# EAGLE design basic-inline-turbidimeter_main_board_v2.1.1 (EAGLE 7.7.0)
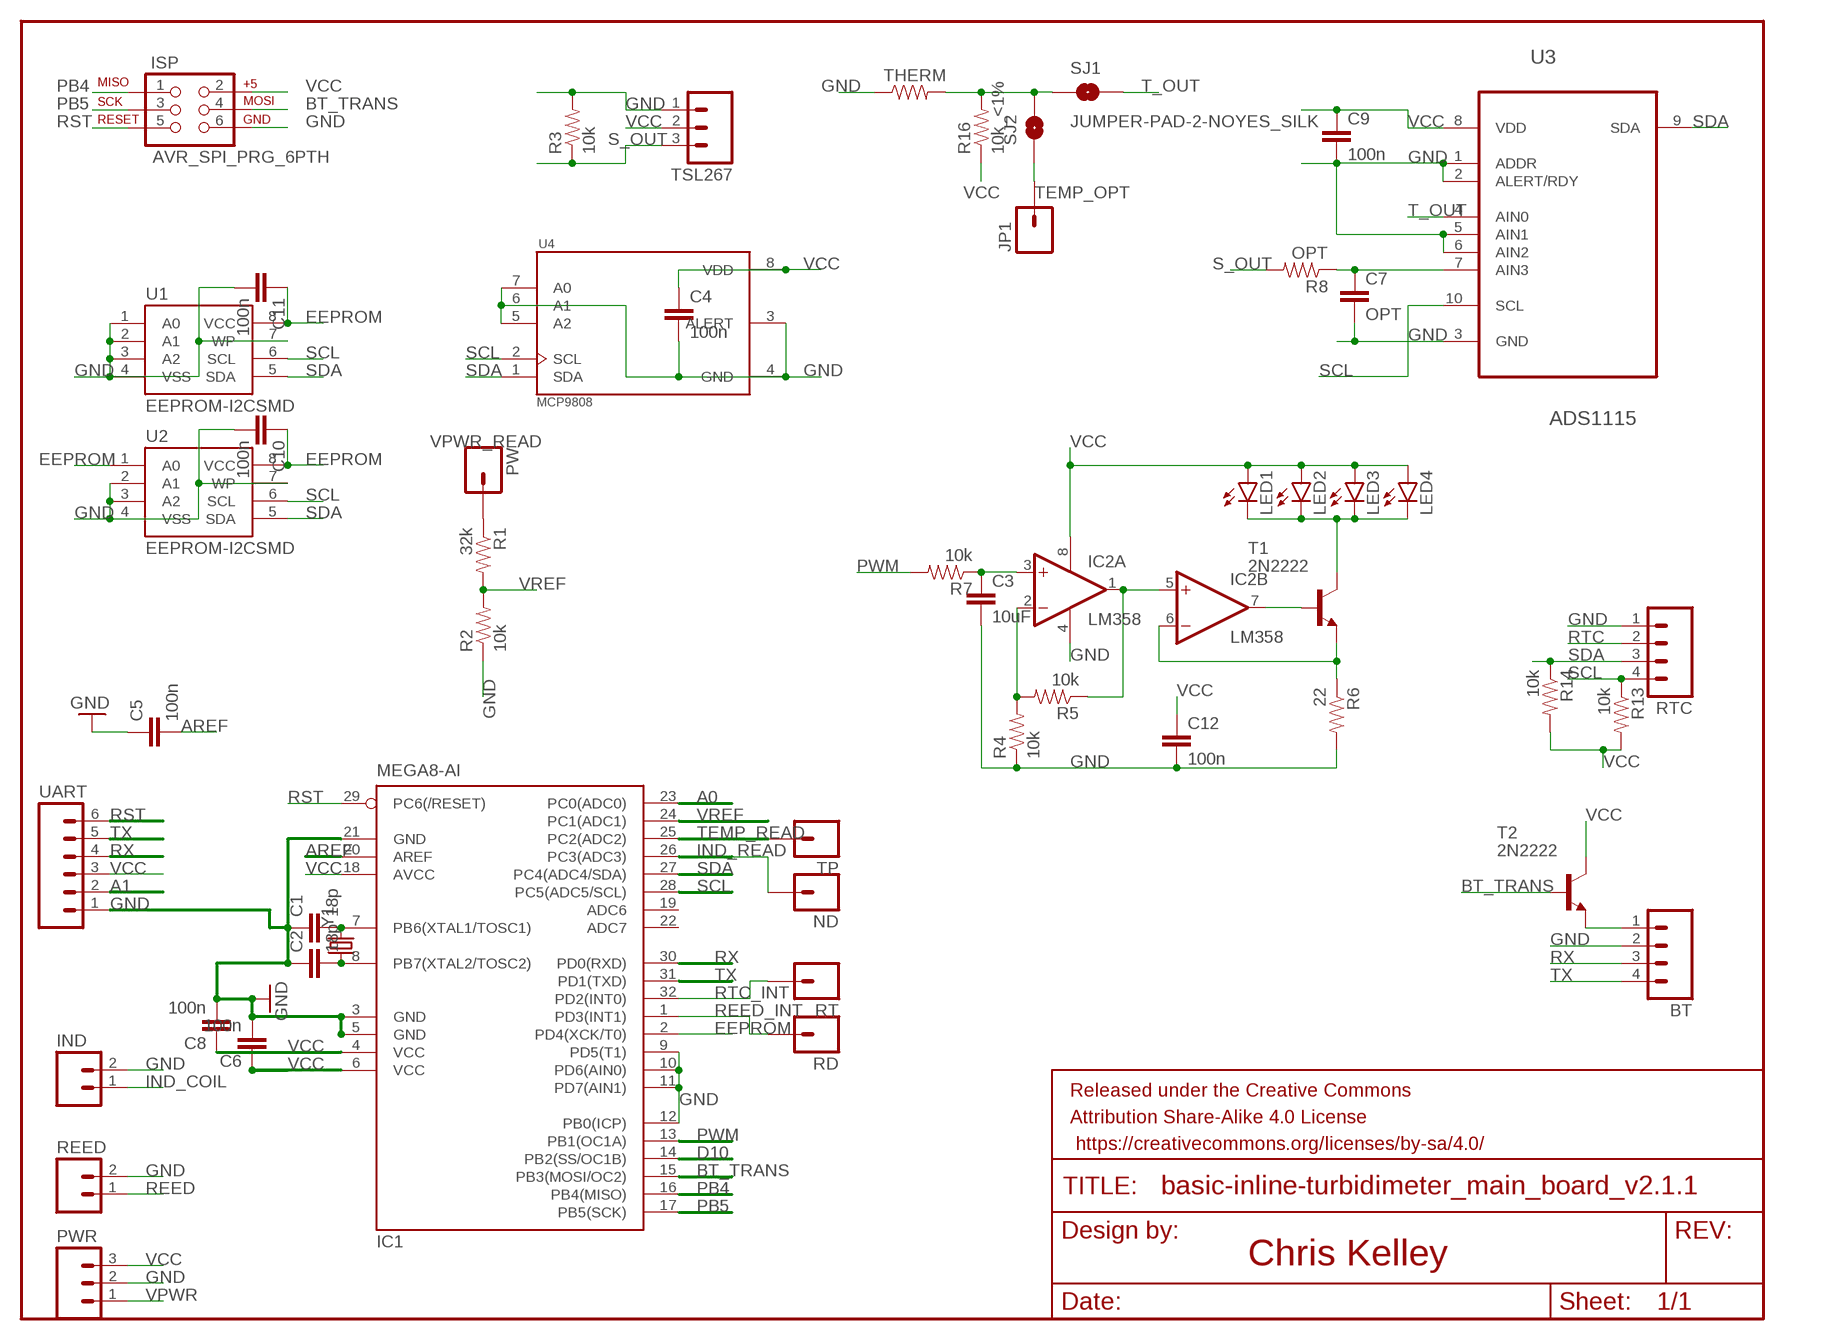
[diagram p0: schematic, sheet 1]

## Parts
BT  M04PTH  [1X04]
C1  18p  CAP0603-CAP  [0603-CAP]
C2  18p  CAP0603-CAP  [0603-CAP]
C3  10uF  CAP0603-CAP  [0603-CAP]
C4  100n  CAP0603-CAP  [0603-CAP]
C5  100n  CAP0603-CAP  [0603-CAP]
C6  100n  CAP0603-CAP  [0603-CAP]
C7  OPT  CAP0603-CAP  [0603-CAP]
C8  100n  CAP0603-CAP  [0603-CAP]
C9  100n  CAP0603-CAP  [0603-CAP]
C10  100n  CAP0603-CAP  [0603-CAP]
C11  100n  CAP0603-CAP  [0603-CAP]
C12  100n  CAP0603-CAP  [0603-CAP]
FRAME1  FRAME-LETTER  [CREATIVE_COMMONS]
IC1  MEGA8-AI  [TQFP32-08]
IC2  LM358  LM358D  [SO08]
IND  M02PTH  [1X02]
ISP  AVR_SPI_PRG_6PTH  [2X3]
JP1  M01PTH  [1X01]
LED1  LED5MM  [LED5MM]
LED2  LED5MM  [LED5MM]
LED3  LED5MM  [LED5MM]
LED4  LED5MM  [LED5MM]
ND  M01PTH  [1X01]
PW  M01PTH  [1X01]
PWR  M03PTH  [1X03]
R1  32k  RESISTOR0603  [0603-RES]
R2  10k  RESISTOR0603  [0603-RES]
R3  10k  RESISTOR0603  [0603-RES]
R4  10k  RESISTOR0603  [0603-RES]
R5  10k  RESISTOR0603  [0603-RES]
R6  22  RESISTOR0603  [0603-RES]
R7  10k  RESISTOR0603  [0603-RES]
R8  OPT  RESISTOR0603  [0603-RES]
R13  10k  RESISTOR0603  [0603-RES]
R14  10k  RESISTOR0603  [0603-RES]
R16  10k_<1%  RESISTOR0603-RES  [0603-RES]
RD  M01PTH  [1X01]
REED  M02PTH  [1X02]
RT  M01PTH  [1X01]
RTC  M04PTH  [1X04]
SJ1  JUMPER-PAD-2-NOYES_SILK  [PAD-JUMPER-2-NO_YES_SILK]
SJ2  JUMPER-PAD-2-NOYES_SILK  [PAD-JUMPER-2-NO_YES_SILK]
T1  2N2222  [TO92-EBC-OVAL]
T2  2N2222  [TO92-EBC-OVAL]
THERM  RESISTOR0603-RES  [0603-RES]
TP  M01PTH  [1X01]
TSL267  M03PTH  [1X03]
U1  EEPROM-I2CSMD  [SO08]
U2  EEPROM-I2CSMD  [SO08]
U3  ADS1115  ADS1115IDGST  [SOP50P490X110-10N]
U4  MCP9808  MCP9808-E/MS  [SOP65P490X110-8N]
UART  M06SILK_FEMALE_PTH  [1X06]
Y1  CRYSTAL5X3  [CRYSTAL-SMD-5X3]

## Nets
A0: IC1.23(PC0(ADC0))
A1: UART.2
AREF: C5.2 IC1.20(AREF)
BT_TRANS: IC1.15(PB3(MOSI/OC2)) ISP.4 T2.B
D10: IC1.14(PB2(SS/OC1B))
EEPROM: C10.1 C11.1 IC1.2(PD4(XCK/T0)) U1.8(VCC) U2.1(A0) U2.8(VCC)
GND: BT.2 C1.1 C2.1 C3.2 C4.2 C5.1 C6.2 C7.2 C8.2 C9.2 C10.2 C11.2 C12.2 IC1.3(GND) IC1.5(GND) IC1.9(PD5(T1)) IC1.10(PD6(AIN0)) IC1.11(PD7(AIN1)) IC1.12(PB0(ICP)) IC1.21(GND) IC2.4(P:V-) IND.2 ISP.6 PWR.2 R2.1 R3.2 R4.1 R6.2 REED.2 RTC.1 THERM.1 TSL267.1 U1.1(A0) U1.2(A1) U1.3(A2) U1.4(VSS) U1.7(WP) U2.2(A1) U2.3(A2) U2.4(VSS) U2.7(WP) U3.1(ADDR) U3.2(ALERT/RDY) U3.3(GND) U3.5(AIN1) U3.6(AIN2) U4.3(ALERT) U4.4(GND) U4.5(A2) U4.6(A1) U4.7(A0) UART.1
IND_COIL: IND.1
IND_READ: IC1.26(PC3(ADC3)) ND.1
N$1: LED1.K(C) LED2.K(C) LED3.K(C) LED4.K(C) T1.C
N$2: C7.1 R8.1 U3.7(AIN3)
N$3: C3.1 IC2.3(A:+IN) R7.1
N$4: IC2.1(A:OUT) IC2.5(B:+IN) R5.1
N$6: IC2.7(B:OUT) T1.B
N$10: IC2.2(A:-IN) R4.2 R5.2
N$11: IC2.6(B:-IN) R6.1 T1.E
N$12: BT.1 T2.E
N$15: R16.2 SJ1.1 SJ2.2 THERM.2
PB4: IC1.16(PB4(MISO)) ISP.1
PB5: IC1.17(PB5(SCK)) ISP.3
PWM: IC1.13(PB1(OC1A)) R7.2
Q1: C2.2 IC1.8(PB7(XTAL2/TOSC2)) Y1.1
Q2: C1.2 IC1.7(PB6(XTAL1/TOSC1)) Y1.3
REED: REED.1
REED_INT: IC1.1(PD3(INT1)) RD.1
RST: IC1.29(PC6(/RESET)) ISP.5 UART.6
RTC: RTC.2
RTC_INT: IC1.32(PD2(INT0)) RT.1
RX: BT.3 IC1.30(PD0(RXD)) UART.4
S_OUT: R3.1 R8.2 TSL267.3
SCL: IC1.28(PC5(ADC5/SCL)) R13.1 RTC.4 U1.6(SCL) U2.6(SCL) U3.10(SCL) U4.2(SCL)
SDA: IC1.27(PC4(ADC4/SDA)) R14.1 RTC.3 U1.5(SDA) U2.5(SDA) U3.9(SDA) U4.1(SDA)
T_OUT: SJ1.2 U3.4(AIN0)
TEMP_OPT: JP1.1 SJ2.1
TEMP_READ: IC1.25(PC2(ADC2)) TP.1
TX: BT.4 IC1.31(PD1(TXD)) UART.5
VCC: C4.1 C6.1 C8.1 C9.1 C12.1 IC1.4(VCC) IC1.6(VCC) IC1.18(AVCC) IC2.8(P:V+) ISP.2 LED1.A LED2.A LED3.A LED4.A PWR.3 R13.2 R14.2 R16.1 T2.C TSL267.2 U3.8(VDD) U4.8(VDD) UART.3
VPWR: PWR.1
VPWR_READ: PW.1 R1.1
VREF: IC1.24(PC1(ADC1)) R1.2 R2.2
Unconnected: IC1.19(ADC6) IC1.22(ADC7)

## Notes on the sheet
- Chris Kelley

## Library data of the parts
BT RTC = SparkFun-Connectors:M04: Header 4 Standard 4-pin 0.1" header. Use with straight break away headers (SKU : PRT-00116), right angle break away headers (PRT-00553), swiss pins (PRT-00743), machine pins (PRT-00117), and female headers (PRT-00115). Molex polarized connector foot print use with SKU : PRT-08231 with associated crimp pins and housings. 1MM SMD Version SKU: PRT-10208
C1-C12 = SparkFun:CAP: Capacitor Standard 0603 ceramic capacitor, and 0.1" leaded capacitor.
FRAME1 = SparkFun-Aesthetics:FRAME-LETTER: Schematic Frame Standard 8.5x11 US Letter frame
IC1 = atmel:MEGA8: MICROCONTROLLER 8 Kbytes FLASH, 1 kbytes SRAM, 512 bytes EEPROM, USART, 6-channel 10 bit ADC, 2-channel 8 bit ADC Pin compatible with Atmega48, ATMega88, ATMega168 Source: avr.lbr; MPN: ATMEGA8-16AU; OC_FARNELL: 9171371; OC_NEWARK: 73M8863
IC2 = linear:LM358: OP AMP also LM158; LM258; LM2904 Source: http://cache.national.com/ds/LM/LM158.pdf
IND REED = SparkFun-Connectors:M02: Standard 2-pin 0.1" header. Use with - straight break away headers ( PRT-00116) - right angle break away headers (PRT-00553) - swiss pins (PRT-00743) - machine pins (PRT-00117) - female headers (PRT-00115) Molex polarized connector foot print use with: PRT-08233 with associated crimp pins and housings. 2.54_SCREWTERM for use with PRT-10571. 3.5mm Screw Terminal footprints for PRT-08084 5mm Screw Terminal footprints for use with PRT-08432
ISP = SparkFun-Connectors:AVR_SPI_PRG_6: AVR ISP 6 Pin This is the reduced ISP connector for AVR programming. Common on Arduino. This footprint will take up less PCB space and can be used with a 10-pin to 6-pin adapter such as SKU: BOB-08508 **Special note about "TEST_POINT" package. The stop mask is on the top side, so if you want your programming test points to be on the bottom of your board, make sure to place this package on the bottom side of the board. This also ensure that the orientation to program from the bottom side will be correct.
JP1 ND PW RD RT TP = SparkFun-Connectors:M01: Header 1 Standard 1-pin 0.1" header. Use with straight break away headers (SKU : PRT-00116), right angle break away headers (PRT-00553), swiss pins (PRT-00743), machine pins (PRT-00117), and female headers (PRT-00115).
LED1-LED4 = SparkFun-LED:LED: LEDs Standard schematic elements and footprints for 5mm, 3mm, 1206, and 0603 sized LEDs. 5mm - Spark Fun Electronics SKU : COM-00529 (and others)
PWR TSL267 = SparkFun-Connectors:M03: Header 3 Standard 3-pin 0.1" header. Use with straight break away headers (SKU : PRT-00116), right angle break away headers (PRT-00553), swiss pins (PRT-00743), machine pins (PRT-00117), and female headers (PRT-00115). Molex polarized connector foot print use with SKU : PRT-08232 with associated crimp pins and housings.
R1-R8 R13 R14 = SparkFun-Resistors:RESISTOR: Resistor Basic schematic elements and footprints for 0603, 1206, and PTH resistors.
R16 THERM = SparkFun-Passives:RESISTOR: Resistor Basic schematic elements and footprints for 0603, 1206, and PTH resistors.
SJ1 SJ2 = SparkFun-Passives:JUMPER-PAD-2-NO
T1 T2 = adafruit:2N2222: NPN TRANSISTOR Big oval pads
U1 U2 = SparkFun-DigitalIC:EEPROM-I2C: I2C EEPROM chips, 24LC256 (and others)
U3 = ADS1115IDGST:ADS1115IDGST: Analog-to-Digital Converter with Internal Reference; AVAILABILITY: Good; DESCRIPTION: 16-Bit ADC with Integrated MUX, PGA, Comparator, Oscillator, and Reference 10-VSSOP -40 to 125; MF: Texas Instruments; MP: ADS1115IDGST; PACKAGE: MSOP-10 Texas Instruments; PRICE: 5.01 USD
U4 = MCP9808-E_MS:MCP9808-E/MS: Board Mount Temperature Sensors Silicon temp sensor with I2C interface; AVAILABILITY: Good; DESCRIPTION: MCP9808 Series SMD 3.6 V Memory Module Digital Temperature Sensor - MSOP-8; MF: Microchip; MP: MCP9808-E/MS; PACKAGE: MSOP-8 Microchip; PRICE: 1.03 USD
UART = SparkFun-Connectors:M06: Header 6 Standard 6-pin 0.1" header. Use with straight break away headers (SKU : PRT-00116), right angle break away headers (PRT-00553), swiss pins (PRT-00743), machine pins (PRT-00117), and female headers (PRT-00115). Molex polarized connector foot print use with SKU : PRT-08094 with associated crimp pins and housings. NOTES ON THE VARIANTS LOCK and LOCK_LONGPADS... This footprint was designed to help hold the alignment of a through-hole component (i.e. 6-pin header) while soldering it into place. You may notice that each hole has been shifted either up or down by 0.005 of an inch from it's more standard position (which is a perfectly straight line). This slight alteration caused the pins (the squares in the middle) to touch the edges of the holes. Because they are alternating, it causes a "brace" to hold the component in place. 0.005 has proven to be the perfect amount of "off-center" position when using our standard breakaway headers. Although looks a little odd when you look at the bare footprint, once you have a header in there, the alteration is very hard to notice. Also,if you push a header all the way into place, it is covered up entirely on the bottom side. This idea of altering the position of holes to aid alignment will be further integrated into the Sparkfun Library for other footprints. It can help hold any component with 3 or more connection pins.; PROD_ID: CONN-08437
Y1 = SparkFun:CRYSTAL: Crystals Various standard crystals. Proven footprints. Spark Fun Electronics SKU : COM-00534

## Board
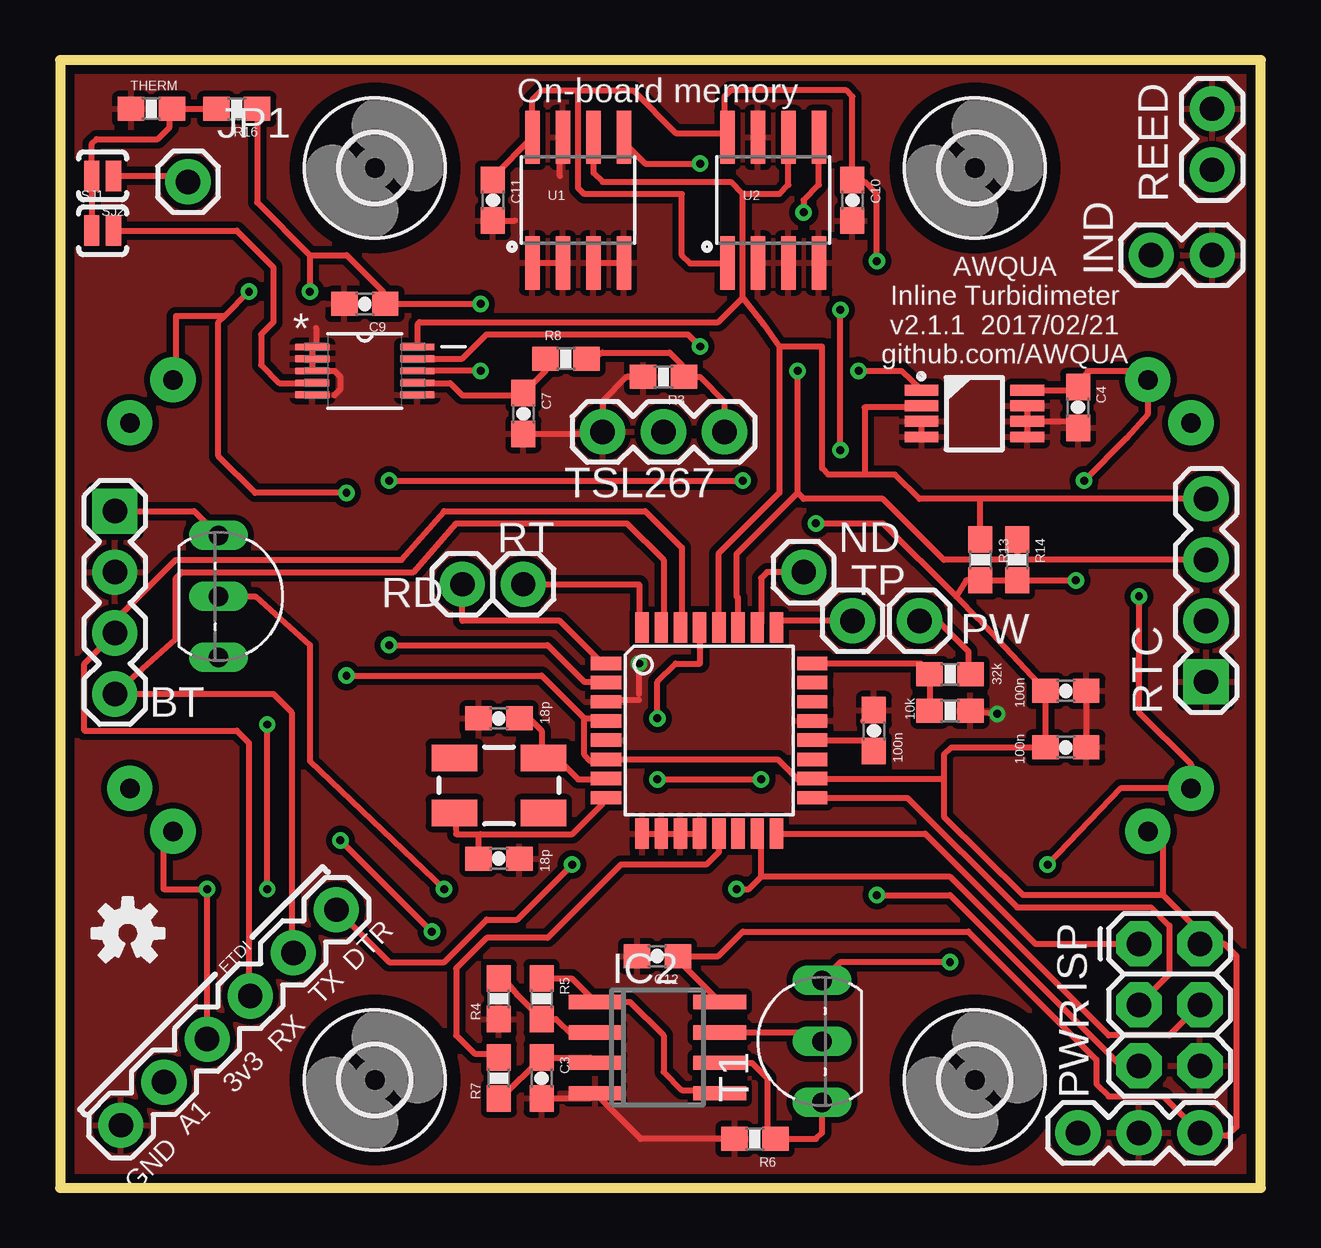
[diagram p1: board, top side]
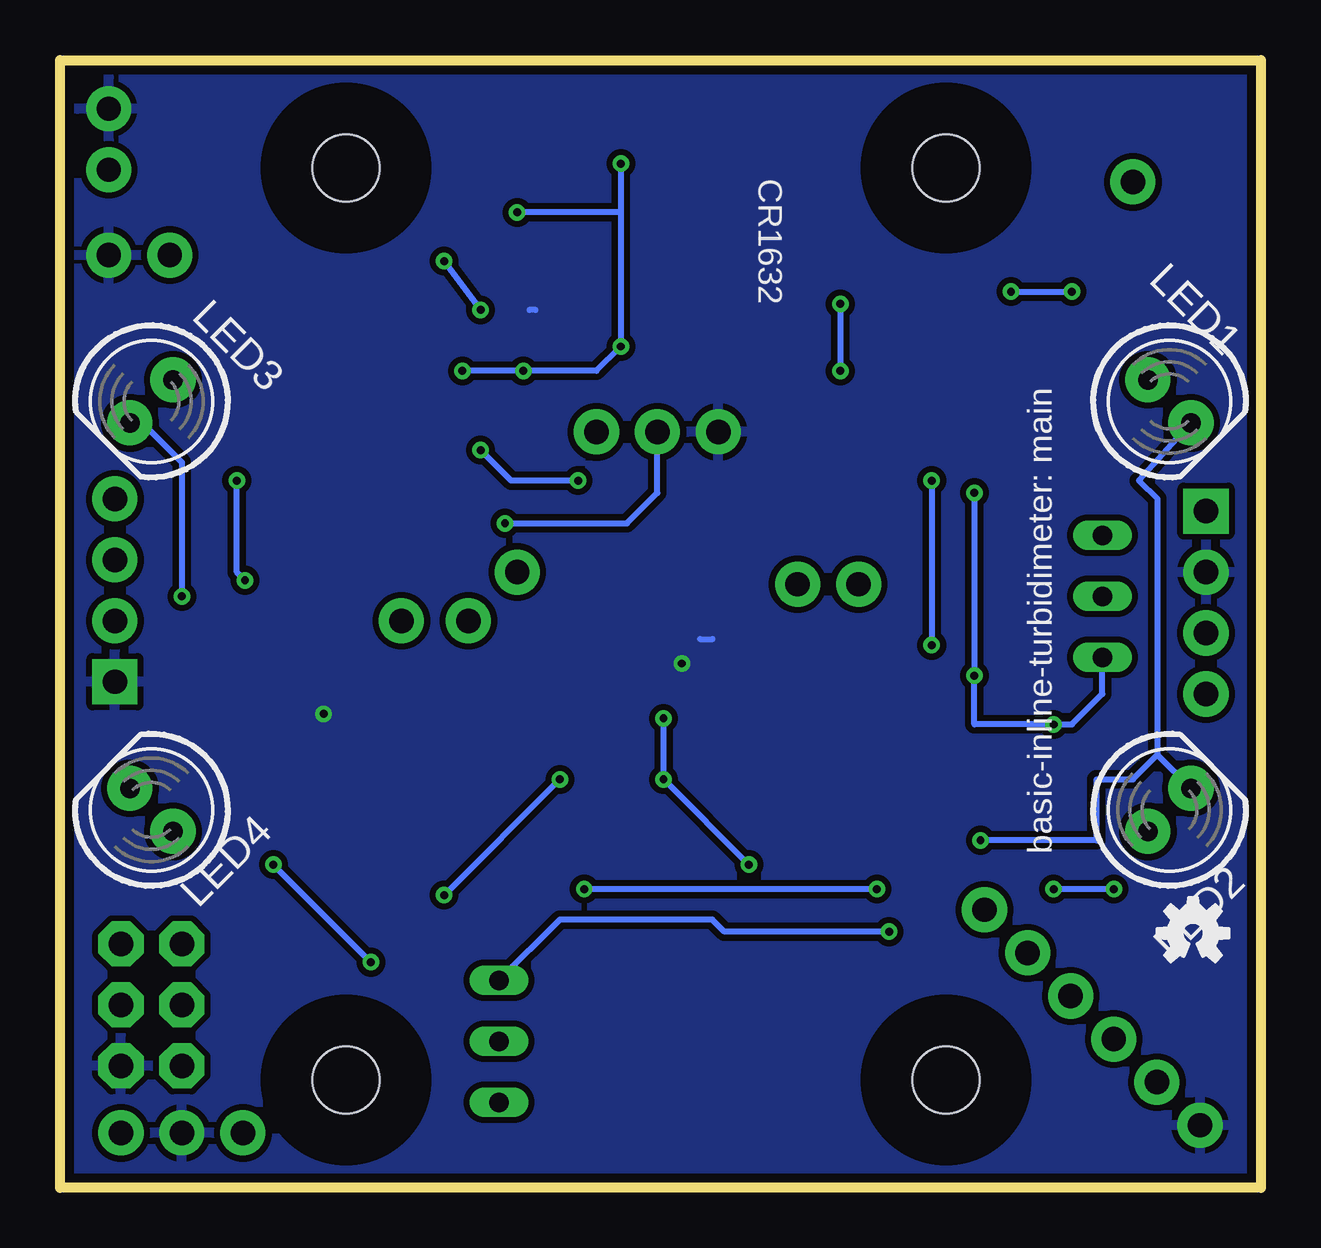
[diagram p2: board, bottom side, seen from below]

Size 50.04 x 46.99 mm. Coordinates in mm from the lower left corner, seen from the top.
Outline: 0,0 50.04,0 50.04,46.99 0,46.99 0,0
Copper layers (1*16): Top 0.0356mm / dielectric 1.5011mm / Bottom 0.0356mm
Design rules "default *": minimum track width 10mil, minimum drill 13mil, track to track 10mil, track to pad 6mil, pad to pad 6mil, via to via 6mil, smd to smd 6mil, copper to edge 15mil, drill to drill 6mil, minimum pad ring 7mil, minimum via ring 7mil, stop-mask expansion 4mil, vias tented up to drill 13mil, thermal gap 10mil

### Footprints (pad centres in the part's own frame; a part is rotated, then mirrored left to right if it is on the bottom)
1X04 = drill 1.016 pad 1.88 square: 1 0,0 | drill 1.016 pad 1.88: 2 2.54,0; 3 5.08,0; 4 7.62,0
0603-CAP = smd 1.1 x 1: 1 -0.85,0; 2 0.85,0
TQFP32-08 = smd 1.27 x 0.559: 1 -4.293,2.8; 2 -4.293,2; 3 -4.293,1.2; 4 -4.293,0.4; 5 -4.293,-0.4; 6 -4.293,-1.2; 7 -4.293,-2; 8 -4.293,-2.8; 17 4.293,-2.8; 18 4.293,-2; 19 4.293,-1.2; 20 4.293,-0.4; 21 4.293,0.4; 22 4.293,1.2; 23 4.293,2; 24 4.293,2.8 | smd 0.559 x 1.27: 9 -2.8,-4.293; 10 -2,-4.293; 11 -1.2,-4.293; 12 -0.4,-4.293; 13 0.4,-4.293; 14 1.2,-4.293; 15 2,-4.293; 16 2.8,-4.293; 25 2.8,4.293; 26 2,4.293; 27 1.2,4.293; 28 0.4,4.293; 29 -0.4,4.293; 30 -1.2,4.293; 31 -2,4.293; 32 -2.8,4.293
SO08 = smd 0.6 x 2.2: 1 -1.905,-2.6; 2 -0.635,-2.6; 3 0.635,-2.6; 4 1.905,-2.6; 5 1.905,2.6; 6 0.635,2.6; 7 -0.635,2.6; 8 -1.905,2.6
1X02 = drill 1.016 pad 1.88: 1 0,0; 2 2.54,0
2X3 = drill 1.016 pad 1.88 octagon: 1 0,0; 2 0,2.54; 3 2.54,0; 4 2.54,2.54; 5 5.08,0; 6 5.08,2.54
1X01 = drill 1.016 pad 1.88: 1 0,0
LED5MM = drill 0.813 pad 1.88: A -1.27,0; K 1.27,0
1X03 = drill 1.016 pad 1.88: 1 0,0; 2 2.54,0; 3 5.08,0
0603-RES = smd 1.1 x 1: 1 -0.85,0; 2 0.85,0
PAD-JUMPER-2-NO_YES_SILK = smd 0.635 x 1.27: 1 -0.45,0; 2 0.45,0
TO92-EBC-OVAL = drill 0.813 long: B 0,-1.27; C 2.54,-1.27; E -2.54,-1.27
SO08' = smd 0.61 x 2.21: 1 -1.905,-2.616; 2 -0.635,-2.616; 3 0.635,-2.616; 4 1.905,-2.616; 5 1.905,2.616; 6 0.635,2.616; 7 -0.635,2.616; 8 -1.905,2.616
SOP50P490X110-10N = smd 1.422 x 0.279: 1 -2.184,0.991; 2 -2.184,0.508; 3 -2.184,0; 4 -2.184,-0.508; 5 -2.184,-0.991; 6 2.184,-0.991; 7 2.184,-0.508; 8 2.184,0; 9 2.184,0.508; 10 2.184,0.991
SOP65P490X110-8N = smd 1.4 x 0.45: 1 -2.2,0.975; 2 -2.2,0.325; 3 -2.2,-0.325; 4 -2.2,-0.975; 5 2.2,-0.975; 6 2.2,-0.325; 7 2.2,0.325; 8 2.2,0.975
2,8 = hole 2.8: 0,0
1X06 = drill 1.016 pad 1.88: 1 0,0; 2 2.54,0; 3 5.08,0; 4 7.62,0; 5 10.16,0; 6 12.7,0
CRYSTAL-SMD-5X3 = smd 1.9 x 1.1: 1 -1.85,-1.15; 2 1.85,-1.15; 3 1.85,1.15; 4 -1.85,1.15

### Placement (x,y rotation side)
BT  2.29,28.19 270 top
C1  18.29,19.56 0 top
C2  18.29,13.72 180 top
C3  20.07,4.57 270 top
C4  42.42,32.51 270 top
C5  33.91,19.05 270 top
C6  41.91,18.35 0 top
C7  19.3,32.26 270 top
C8  41.91,20.7 0 top
C9  12.7,36.83 180 top
C10  33.02,41.15 270 top
C11  18.03,41.15 270 top
C12  24.89,9.65 180 top
FRAME1  -3.05,-10.41 0 top  (outside the outline)
IC1  27.05,19.05 0 top
IC2  24.89,5.84 270 top
IND  45.47,38.86 0 top
ISP  44.96,10.16 270 top
JP1  5.33,41.91 0 top
LED1  3.81,32.77 315 bottom
LED2  3.81,15.75 45 bottom
LED3  46.23,32.77 225 bottom
LED4  46.23,15.75 135 bottom
ND  30.99,25.65 0 top
PW  35.81,23.62 0 top
PWR  42.42,2.29 0 top
R1  37.08,21.4 180 top
R2  37.08,19.88 180 top
R3  25.15,33.78 180 top
R4  18.29,7.87 90 top
R5  20.07,7.87 270 top
R6  28.96,2.03 180 top
R7  18.29,4.57 90 top
R8  21.08,34.54 0 top
R13  38.35,26.16 270 top
R14  39.88,26.16 270 top
R16  7.37,44.96 180 top
RD  16.76,25.15 0 top
REED  48.01,42.42 90 top
RT  19.3,25.15 0 top
RTC  47.75,21.08 90 top
SJ1  1.78,39.88 0 top
SJ2  1.78,42.16 180 top
T1  30.48,6.1 90 top
T2  7.87,24.64 270 top
THERM  3.81,44.96 0 top
TP  33.02,23.62 0 top
TSL267  22.61,31.5 0 top
U1  EEPROM-I2CSMD  [SO08']  21.59,41.15 0 top
U2  EEPROM-I2CSMD  [SO08']  29.72,41.15 0 top
U3  12.7,34.04 0 top
U4  38.1,32.26 0 top
U$1  [2,8]  13.12,42.49 0 top
U$2  [OSHW-LOGO-S]  2.83,10.6 0 top
U$3  [2,8]  38.12,42.49 0 top
U$5  [2,8]  38.12,4.49 0 top
U$6  [2,8]  13.12,4.49 0 top
U$8  [OSHW-LOGO-S]  2.83,10.6 0 bottom
UART  2.54,2.6 45 top
Y1  18.29,16.76 0 top

### Tracks (layer width: path | path; a pad name or v marks a point on that pad's centre or on a via)
AREF
  Top 0.254: IC1.20 33.46,18.65 C5.2
BT_TRANS  (via drill 0.33)
  Top 0.254: T2.B 8.13,24.64 10.41,22.61 10.41,17.78 v16,12.45 | v28.19,12.45 28.7,12.45 29.21,12.95 | 29.21,12.95 29.21,14.6 IC1.15 | ISP.4 46.23,6.35 43.69,6.35 37.08,12.95 29.21,12.95
  Bottom 0.254: v16,12.45 v28.19,12.45
EEPROM  (via drill 0.33)
  Top 0.254: C11.1 18.03,42.11 U1.8 19.68,45.34 20.07,45.72 21.59,45.72 | C10.1 33.02,45.47 32.77,45.72 27.94,45.72 27.69,45.47 27.69,43.94 | 27.69,43.94 27.69,43.89 | 21.59,45.72 23.88,45.72 25.65,43.94 27.64,43.94 | 27.64,43.94 U2.8 | 21.59,45.72 21.59,41.66 21.84,41.4 25.91,41.4 25.91,38.86 26.25,38.52 U2.1 | v13.72,29.46 v28.45,29.46 | v32.51,30.73 v32.51,36.58 | 33.19,41.91 C10.1 | v13.72,22.61 20.32,22.61 21.84,21.08 22.73,21.08 IC1.2 | v34.04,38.61 34.04,41.4 33.53,41.91 33.11,41.91 C10.1 | 27.64,43.94 27.69,43.94
  Bottom 0.254: v28.45,29.46 31.24,29.46 v32.51,30.73 | v13.72,29.46 v13.72,22.61 | v32.51,36.58 v34.04,38.61
GND  (via drill 0.33)
  Top 0.254: 18.03,40.18 C11.2 18.96,40.3 | U1.1 U1.2 | U1.3 U1.4 | 20.83,42.16 20.83,43.64 U1.7 | R3.2 23.62,33.78 22.61,32.77 TSL267.1 22.52,31.41 C7.2 | 33.46,19.45 C5.1 | C3.2 22.08,3.72 IC2.4 | IC2.4 22.64,3.94 | R6.2 24.2,2.03 IC2.4 | R2.1 v39.05,19.75 | C9.2 11.68,36.83 | 10.67,35.81 10.67,35.18 U3.1 U3.2 U3.3 11.43,34.04 11.68,33.78 11.68,33.27 11.43,33.02 | C8.2 C6.2 | 24.13,20.32 22.83,20.32 IC1.3 | 10.54,33.02 U3.5 | 31.7,38.61 U2.4 | 30.43,38.61 U2.3 | U4.7 U4.6 | U4.6 U4.5 | U4.6 42.15,31.93 C4.2 | U4.4 U4.3 | 24.13,20.57 v24.13,21.84 | IC1.9 IC1.10 IC1.11 IC1.12
  Bottom 0.254: 23.37,22.86 22.86,22.86 | 30.23,36.58 30.48,36.58
  pour Bottom: 50.99,49.59 -1.21,49.59 -1.21,-0.95 51.24,-0.95
  pour Top: -4.57,49.28 53.34,49.28 53.34,-2.29 -4.57,-2.29
IND_READ
  Top 0.254: ND.1 29.46,25.65 29.21,25.4 29.21,23.5 IC1.26
N$1  (via drill 0.33)
  Top 0.254: v44.96,24.64 44.96,19.81 47.13,17.64 LED4.K 44.2,16.64 v41.15,13.46 | v37.08,9.4 32.51,9.4 T1.C | v11.68,14.48 v15.49,10.67
  Bottom 0.254: LED1.K 5.08,29.46 4.32,28.7 4.32,18.03 | 4.32,18.03 LED2.K | LED3.K 46.62,31.87 44.96,30.23 v44.96,24.64 | v41.15,13.46 v37.08,9.4 | v11.68,14.48 6.86,14.48 6.86,17.02 5.33,17.02 4.32,18.03 | v15.49,10.67 22.35,10.67 22.86,11.18 29.21,11.18 T1.C
N$2
  Top 0.254: R8.1 20.23,34.04 C7.1 19.22,33.02 16.76,33.02 16.26,33.53 U3.7
N$3
  Top 0.254: IC2.3 22.08,5.42 C3.1 18.37,3.72 R7.1
N$4
  Top 0.254: R5.1 21.32,8.72 IC2.1 23.75,7.75 25.15,6.35 25.15,4.83 25.91,4.06 27.36,4.06 IC2.5
N$6
  Top 0.254: IC2.7 31.37,6.48 T1.B
N$10
  Top 0.254: IC2.2 22.16,6.35 21.34,6.35 20.66,7.02 R5.2 19.05,8.04 18.54,8.64 18.45,8.72 R4.2
N$11
  Top 0.254: IC2.6 28.83,5.21 29.46,4.57 29.46,2.37 R6.1 31.5,2.03 31.75,2.29 T1.E
N$12
  Top 0.254: BT.1 5.59,28.19 T2.E
N$15
  Top 0.254: SJ1.1 SJ2.2 1.33,43.49 1.52,43.69 4.06,43.69 4.57,44.2 4.57,44.87 THERM.2 R16.2
PB4
  Top 0.254: IC1.16 36.04,14.76 40.64,10.16 ISP.1
PB5
  Top 0.254: IC1.17 35.31,16.25 39.88,11.68 45.47,11.68 46.23,10.92 46.23,8.89 ISP.3
PWM
  Top 0.254: IC1.13 27.45,13.99 26.92,13.46 23.37,13.46 20.32,10.41 17.78,10.41 16.51,9.14 16.51,6.35 17.27,5.59 18.12,5.59 R7.2
Q1
  Top 0.254: Y1.1 16.51,14.73 17.53,14.73 | 17.53,14.73 21.34,14.73 22.61,16 22.61,16.1 IC1.8 | C2.2 17.44,14.64 17.53,14.73
Q2
  Top 0.254: IC1.7 22.73,17.02 21.59,17.02 20.69,17.91 Y1.3 20.07,17.99 20.07,19.05 19.56,19.56 C1.2
REED_INT
  Top 0.254: IC1.1 22.6,21.85 20.83,23.62 16.76,23.62 RD.1
RST  (via drill 0.33)
  Top 0.254: UART.6 11.53,11.58 13.72,9.4 16,9.4 17.78,11.18 19.05,11.18 v21.34,13.46 | v24.89,19.56 24.89,21.08 25.65,21.84 26.67,21.84 26.67,23.32 IC1.29 | v24.89,17.02 v29.21,17.02 | v34.04,12.19 37.08,12.19 44.2,5.08 ISP.5
  Bottom 0.254: v21.34,13.46 v24.89,17.02 v24.89,19.56 | v29.21,17.02 v34.04,12.19
RTC_INT
  Top 0.254: RT.1 24.13,25.15 24.13,23.46 IC1.32
RX
  Top 0.254: IC1.30 25.91,23.4 25.91,26.67 24.38,28.19 16,28.19 14.22,26.16 4.83,26.16 2.29,23.62 BT.3 1.02,21.84 1.02,19.05 7.37,19.05 7.87,18.54 7.87,8.04 UART.4
S_OUT
  Top 0.254: TSL267.3 27.69,32.77 26.67,33.78 R3.1 25.91,33.87 25.91,34.29 25.4,34.8 22.61,34.8 22.1,34.54 R8.2
SCL
  Top 0.254: U1.6 22.23,42.29 22.61,41.91 27.94,41.91 28.45,41.4 | 28.45,41.4 29.97,41.4 30.35,41.78 U2.6 | 28.45,37.08 28.45,41.4 | 28.45,37.08 29.3,35.99 29.97,35.05 | 29.97,35.05 29.97,28.96 27.43,26.42 27.43,23.36 IC1.28 | RTC.4 38.35,28.7 | 38.35,28.7 35.81,28.7 34.8,29.72 33.53,29.72 | 33.53,29.72 32,29.72 31.75,29.97 31.75,35.05 29.97,35.05 | R13.1 38.35,28.7 | U3.10 14.91,35.05 14.91,35.99 14.99,36.07 27.43,36.07 28.45,37.08 | U4.2 35.63,32.51 33.53,32.51 33.53,29.72
SDA  (via drill 0.33)
  Top 0.254: U1.5 23.5,43.56 24.38,42.67 v26.67,42.67 | v30.99,40.64 30.99,41.15 31.62,41.78 U2.5 | IC1.27 28.25,24.58 28.19,24.64 28.19,26.42 30.73,28.96 | 30.73,28.96 v30.73,34.04 | RTC.3 39.88,26.16 | 39.88,26.16 36.83,26.16 34.29,28.7 30.99,28.7 30.73,28.96 | U3.9 16.76,34.54 17.78,35.56 26.16,35.56 v26.67,35.05 | R14.1 39.88,26.16 | v33.27,34.04 35.05,34.04 35.86,33.27 U4.1
  Bottom 0.254: v26.67,42.67 26.67,40.64 | 26.67,40.64 v26.67,35.05 27.69,34.04 v30.73,34.04 v33.27,34.04 | 26.67,40.64 v30.99,40.64
T_OUT
  Top 0.254: U3.4 9.14,33.53 8.38,34.29 8.38,35.56 8.89,36.07 8.89,38.35 7.37,39.88 SJ1.2
TEMP_OPT
  Top 0.254: SJ2.1 5.08,42.16 JP1.1
TEMP_READ
  Top 0.254: TP.1 29.97,23.62 29.97,23.46 IC1.25
TX
  Top 0.254: IC1.31 25.15,23.44 25.15,26.16 23.62,27.69 16.51,27.69 14.73,25.65 5.08,25.65 4.83,25.4 4.83,22.86 BT.4 8.89,20.57 9.65,19.81 9.65,9.86 UART.5
VCC  (via drill 0.33)
  Top 0.254: IC2.8 25.74,9.5 C12.1 27.43,9.65 28.45,10.67 37.85,10.67 43.18,5.33 43.18,4.32 43.69,3.81 45.97,3.81 PWR.3 47.62,2.16 48.64,2.16 49.02,2.54 49.02,9.65 48.51,10.16 ISP.2 47.5,10.67 45.97,12.19 | R16.1 8.22,41.06 10.41,38.86 | 45.97,12.19 40.13,12.19 36.83,15.46 36.83,17.05 | 36.83,17.05 IC1.18 31.31,17.02 30.73,17.02 29.9,17.85 IC1.6 22.69,17.78 22.1,17.78 21.84,18.03 21.84,19.56 | 36.83,17.05 36.83,18.03 37.15,18.35 C6.1 C8.1 38.27,23.71 37.34,24.64 | v31.5,27.69 34.29,27.69 37.34,24.64 | 37.34,24.64 37.76,25.31 R13.2 R14.2 v42.33,25.31 | 10.41,38.86 11.94,38.86 13.46,37.34 13.46,36.92 C9.1 v17.53,36.83 | v17.53,34.04 U3.8 | UART.3 v6.13,12.45 4.32,12.45 4.32,14.46 LED2.A | v8.64,12.45 v8.64,19.3 | v11.94,21.34 20.07,21.34 21.84,19.56 | 21.84,19.56 22.65,19.56 IC1.4 | 45.97,12.19 45.97,14.48 LED4.A | v42.67,29.46 44.45,31.24 45.34,32.26 LED3.A 44.96,34.04 42.84,34.04 C4.1 42.29,33.23 U4.8 | 10.41,38.86 v10.41,37.34 | v7.87,37.34 6.86,36.32 | 6.86,36.32 4.83,36.32 4.83,33.78 LED1.A | v11.94,28.96 8.13,28.96 6.6,30.48 6.6,36.07 6.86,36.32
  Bottom 0.254: v31.5,27.69 26.42,27.69 25.15,28.96 TSL267.2 | v17.53,36.83 v17.53,34.04 | v6.13,12.45 v8.64,12.45 | T2.C 6.6,20.57 7.87,19.3 v8.64,19.3 11.94,19.3 v11.94,21.34 v11.94,28.96 | v42.67,29.46 42.67,25.65 v42.33,25.31 | v10.41,37.34 v7.87,37.34
VPWR_READ
  Top 0.254: PW.1 36.58,23.62 37.85,22.35 37.85,21.49 R1.1
VREF
  Top 0.254: R2.2 R1.2 35.84,21.85 IC1.24

### Text on the board
tPlace: AWQUA / Inline Turbidimeter / v2.1.1 2017/02/21 / github.com/AWQUA | DTR | FTDI | TX | RX | 3v3 | A1 | GND
tNames: On-board memory | Chris Kelley
bNames: CR1632 | basic-inline-turbidimeter: main